# Altium schematic sheet Ant_V1_Sheet.SchDoc: AntV1
size A3; Author: Mrike.latefly; DocumentNumber: 5; Revision: v0.0.01; DocumentName: Ant_V1
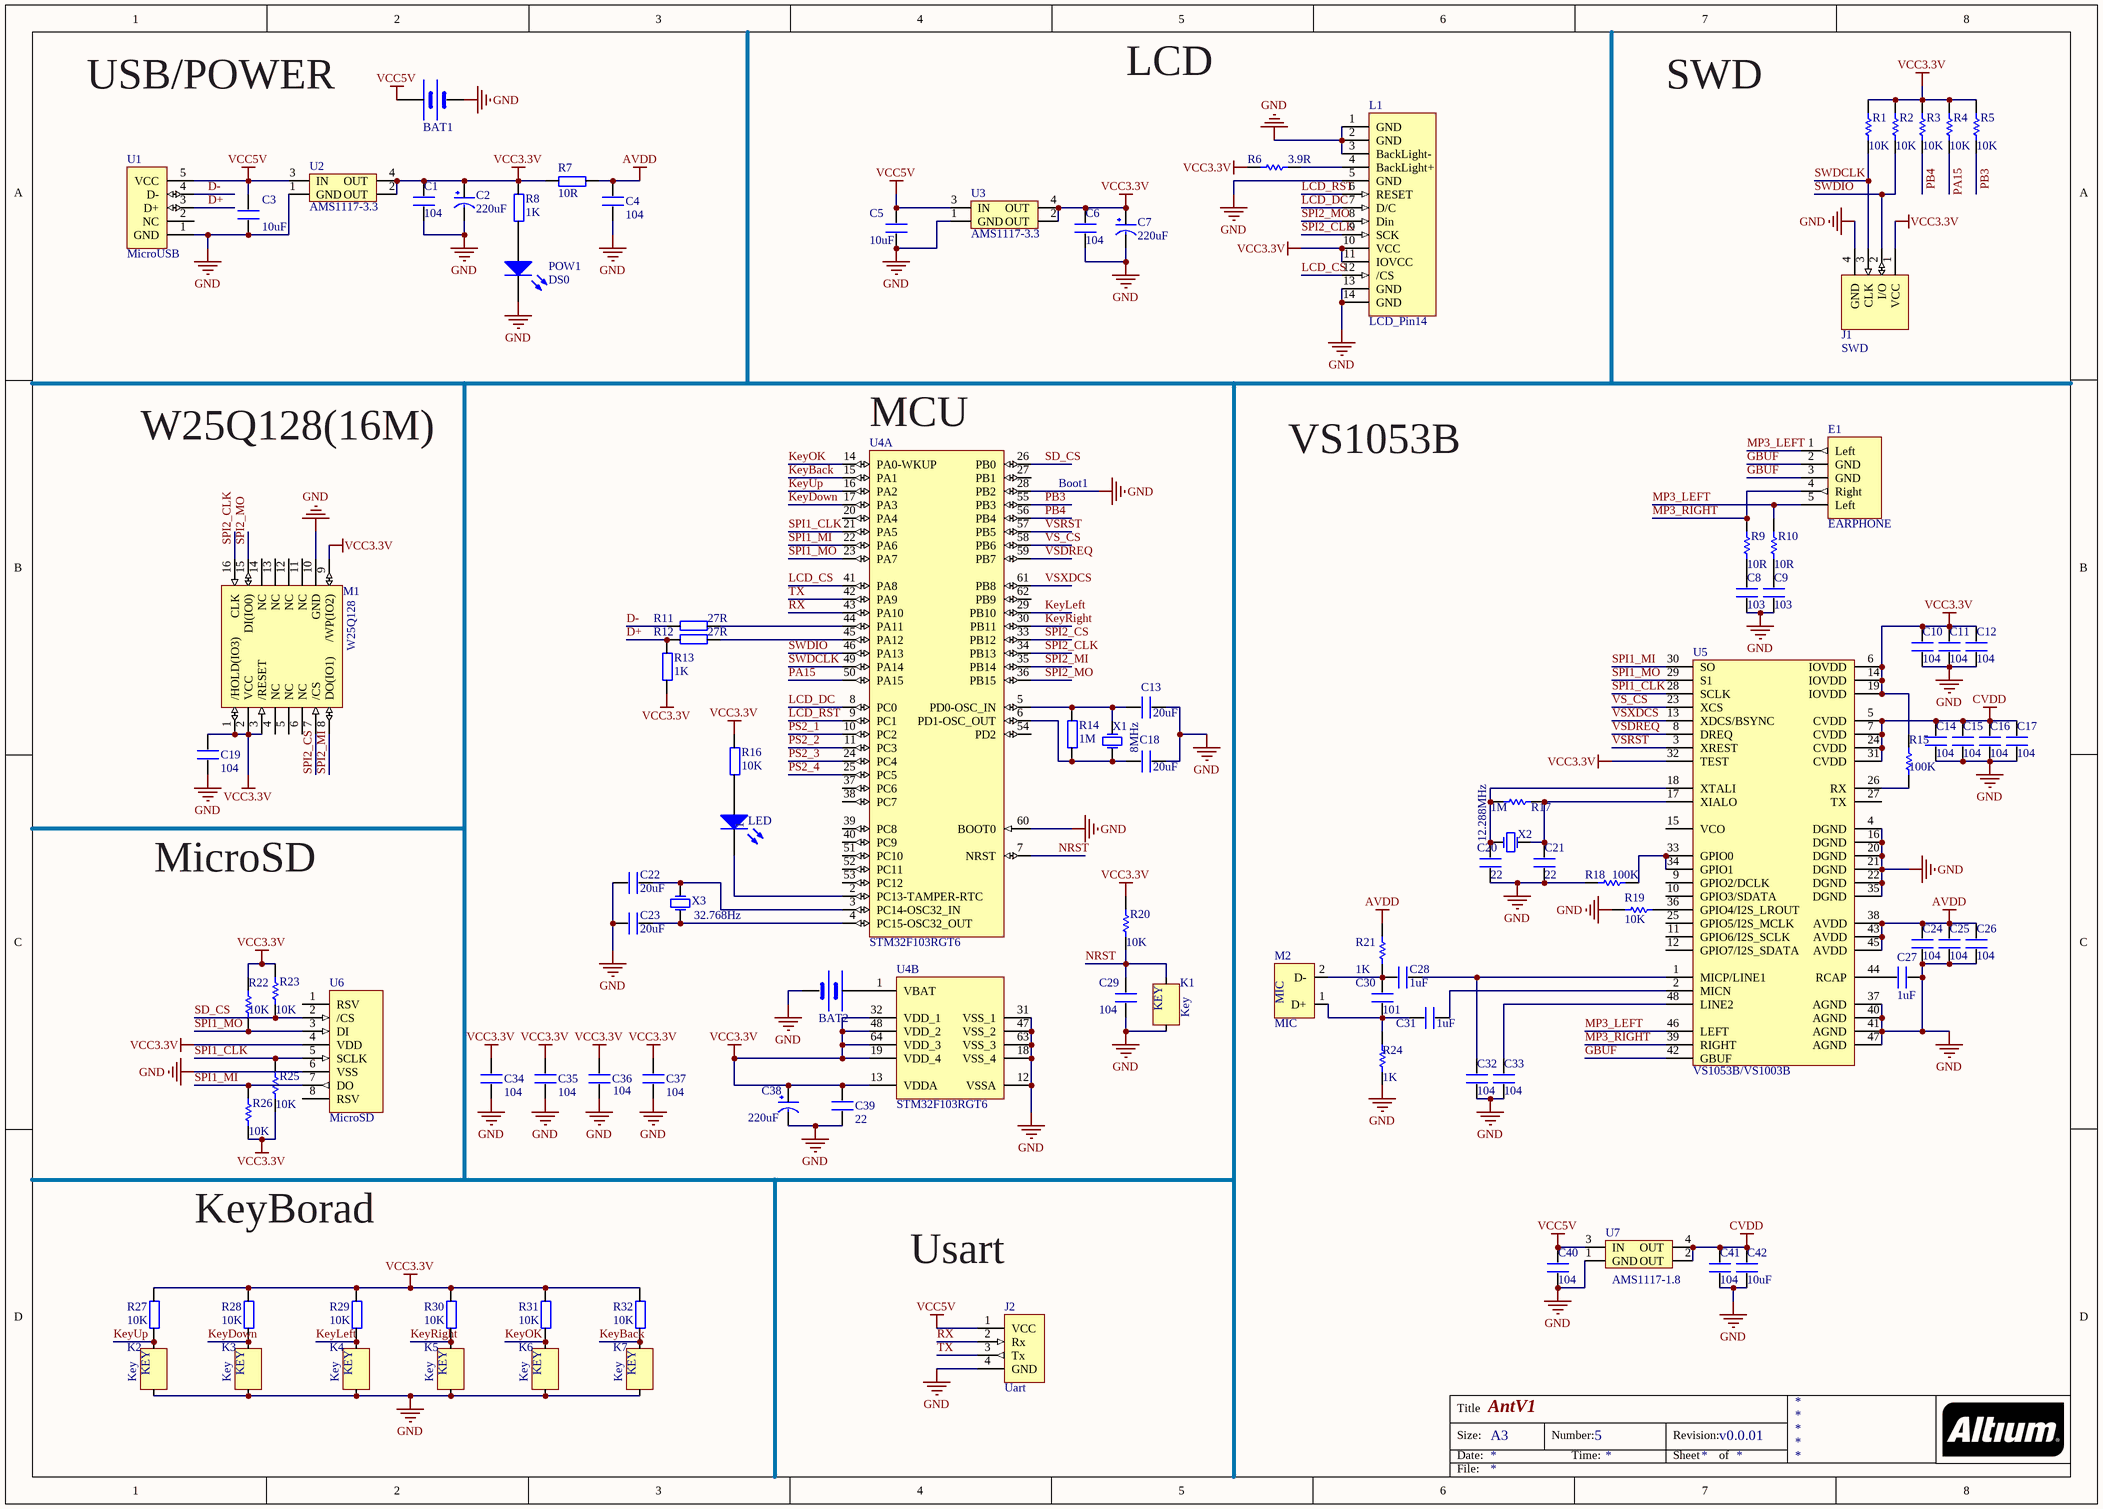
[diagram p0: Ant_V1_Sheet.SchDoc]

## Parts
1  LED  [LED_LITTLE]
BAT1  BATT  [BATTERY]  (value not drawn)
BAT2  BATT  [BATTERY]  (value not drawn)
C1  104  [0805]
C2  220uF  [0805]
C3  10uF  [0805]
C4  104  [0805]
C5  10uF  [0805]
C6  104  [0805]
C7  220uF  [0805]
C8  103  [0805]
C9  103  [0805]
C10  104  [0805]
C11  104  [0805]
C12  104  [0805]
C13  20uF  [0805]
C14  104  [0805]
C15  104  [0805]
C16  104  [0805]
C17  104  [0805]
C18  20uF  [0805]
C19  104  [0805]
C20  22  [0805]
C21  22  [0805]
C22  20uF  [0805]
C23  20uF  [0805]
C24  104  [0805]
C25  104  [0805]
C26  104  [0805]
C27  1uF  [0805]
C28  1uF  [0805]
C29  104  [0805]
C30  101  [0805]
C31  1uF  [0805]
C32  104  [0805]
C33  104  [0805]
C34  104  [0805]
C35  104  [0805]
C36  104  [0805]
C37  104  [0805]
C38  220uF  [0805]
C39  22  [0805]
C40  104  [0805]
C41  104  [0805]
C42  10uF  [0805]
E1  EARPHONE  [EARPHONE]
J1  SWD  [SWD]
J2  Uart  [Uart]
K1  Key  [KEY]
K2  Key  [KEY]
K3  Key  [KEY]
K4  Key  [KEY]
K5  Key  [KEY]
K6  Key  [KEY]
K7  Key  [KEY]
L1  LCD_Pin14  [LCD_PIN14_Rctify]
M1  W25Q128  [W25Q128]
M2  MIC  [MIC]
POW1  DS0  [LED_LITTLE]
R1  10K  [0805]
R2  10K  [0805]
R3  10K  [0805]
R4  10K  [0805]
R5  10K  [0805]
R6  3.9R  [0805]
R7  10R  [0805]
R8  1K  [0805]
R9  10R  [0805]
R10  10R  [0805]
R11  27R  [0805]
R12  27R  [0805]
R13  1K  [0805]
R14  1M  [0805]
R15  100K  [0805]
R16  10K  [0805]
R17  1M  [0805]
R18  100K  [0805]
R19  10K  [0805]
R20  10K  [0805]
R21  1K  [0805]
R22  10K  [0805]
R23  10K  [0805]
R24  1K  [0805]
R25  10K  [0805]
R26  10K  [0805]
R27  10K  [0805]
R28  10K  [0805]
R29  10K  [0805]
R30  10K  [0805]
R31  10K  [0805]
R32  10K  [0805]
U1  MicroUSB  [USB]
U2  AMS1117-3.3  [AMS1117]
U3  AMS1117-3.3  [AMS1117]
U4  STM32F103RGT6  [STM-LQFP64_M]  (parts A,B of 2)
U5  VS1053B/VS1003B  [mTQFP48]
U6  MicroSD  [MICROSD]
U7  AMS1117-1.8  [AMS1117]
X1  8MHz  [XTAL_8M]
X2  12.288MHz  [XTAL_12.288M]
X3  32.768Hz  [XTAL32.768K_4Pin']

## Nets
AVDD: C4.2 C24.1 C25.1 C26.1 R7.2 R21.1 U5.38(AVDD) U5.43(AVDD) U5.45(AVDD)
CVDD: C14.1 C15.1 C16.1 C17.1 C41.2 C42.2 U5.5(CVDD) U5.7(CVDD) U5.24(CVDD) U5.31(CVDD) U7.2(OUT) U7.4(OUT)
GND: BAT1.2(GND) BAT2.2(GND) C1.1 C2.2(GND) C3.1 C4.1 C5.1 C6.1 C7.2(GND) C8.2 C9.2 C10.2 C11.2 C12.2 C13.2 C14.2 C15.2 C16.2 C17.2 C18.2 C19.2 C20.2 C21.2 C22.1 C23.1 C24.2 C25.2 C26.2 C27.2 C29.1 C32.1 C33.1 C34.1 C35.1 C36.1 C37.1 C38.2(GND) C39.1 C40.1 C41.1 C42.1 J1.4(GND) J2.4(GND) K1.2(GND) K2.2(GND) K3.2(GND) K4.2(GND) K5.2(GND) K6.2(GND) K7.2(GND) L1.1(GND) L1.2(GND) L1.3(BackLight-) L1.5(GND) L1.13(GND) L1.14(GND) M1.10(GND) POW1.2(K) R18.2 R19.1 R24.2 U1.1(GND) U2.1(GND) U3.1(GND) U4.12(VSSA) U4.18(VSS_4) U4.28(PB2) U4.31(VSS_1) U4.47(VSS_2) U4.60(BOOT0) U4.63(VSS_3) U5.4(DGND) U5.16(DGND) U5.20(DGND) U5.21(DGND) U5.22(DGND) U5.35(DGND) U5.37(AGND) U5.40(AGND) U5.41(AGND) U5.47(AGND) U6.6(VSS) U7.1(GND)
VCC3.3V: C1.2 C2.1(VCC) C6.2 C7.1(VCC) C10.1 C11.1 C12.1 C19.1 C34.2 C35.2 C36.2 C37.2 C38.1(VCC) C39.2 J1.1(VCC) L1.10(VCC) L1.11(IOVCC) M1.1(/HOLD(IO3)) M1.2(VCC) M1.3(/RESET) M1.9(/WP(IO2)) R1.2 R2.2 R3.2 R4.2 R5.2 R6.2 R7.1 R8.2 R13.1 R15.2 R16.2 R20.2 R22.2 R23.2 R25.1 R26.1 R27.2 R28.2 R29.2 R30.2 R31.2 R32.2 U2.2(OUT) U2.4(OUT) U3.2(OUT) U3.4(OUT) U4.13(VDDA) U4.19(VDD_4) U4.32(VDD_1) U4.48(VDD_2) U4.64(VDD_3) U5.6(IOVDD) U5.14(IOVDD) U5.19(IOVDD) U5.32(TEST) U6.4(VDD)
VCC5V: BAT1.1(VCC) C3.2 C5.2 C40.2 J2.1(VCC) U1.5(VCC) U2.3(IN) U3.3(IN) U7.3(IN)
D+: R12.2 R13.2 U1.3(D+)
D-: R11.2 U1.4(D-)
GBUF: E1.2(GND) E1.3(GND) U5.42(GBUF)
KeyBack: K7.1(GND) R32.1 U4.15(PA1)
KeyDown: K3.1(GND) R28.1 U4.17(PA3)
KeyLeft: K4.1(GND) R29.1 U4.29(PB10)
KeyOK: K6.1(GND) R31.1 U4.14(PA0-WKUP)
KeyRight: K5.1(GND) R30.1 U4.30(PB11)
KeyUp: K2.1(GND) R27.1 U4.16(PA2)
LCD_CS: L1.12(/CS) U4.41(PA8)
LCD_DC: L1.7(D/C) U4.8(PC0)
LCD_RST: L1.6(RESET) U4.9(PC1)
MP3_LEFT: E1.1(Left) E1.5(Left) R10.2 U5.46(LEFT)
MP3_RIGHT: E1.4(Right) R9.2 U5.39(RIGHT)
NRST: C29.2 K1.1(GND) R20.1 U4.7(NRST)
PA15: R4.1 U4.50(PA15)
PB3: R5.1 U4.55(PB3)
PB4: R3.1 U4.56(PB4)
PS2_1: U4.10(PC2)
PS2_2: U4.11(PC3)
PS2_3: U4.24(PC4)
PS2_4: U4.25(PC5)
RX: J2.2(Rx) U4.43(PA10)
SD_CS: R23.1 U4.26(PB0) U6.2(/CS)
SPI1_CLK: R25.2 U4.21(PA5) U5.28(SCLK) U6.5(SCLK)
SPI1_MI: R26.2 U4.22(PA6) U5.30(SO) U6.7(DO)
SPI1_MO: R22.1 U4.23(PA7) U5.29(S1) U6.3(DI)
SPI2_CLK: L1.9(SCK) M1.16(CLK) U4.34(PB13)
SPI2_CS: M1.7(/CS) U4.33(PB12)
SPI2_MI: M1.8(DO(IO1)) U4.35(PB14)
SPI2_MO: L1.8(Din) M1.15(DI(IO0)) U4.36(PB15)
SWDCLK: J1.3(CLK) R1.1 U4.49(PA14)
SWDIO: J1.2(I/O) R2.1 U4.46(PA13)
TX: J2.3(Tx) U4.42(PA9)
VS_CS: U4.58(PB6) U5.23(XCS)
VSDREQ: U4.59(PB7) U5.8(DREQ)
VSRST: U4.57(PB5) U5.3(XREST)
VSXDCS: U4.61(PB8) U5.13(XDCS/BSYNC)
Net1_1: 1.1(A) R16.1
Net1_2: 1.2(K) U4.2(PC13-TAMPER-RTC)
NetBAT2_1: BAT2.1(VCC) U4.1(VBAT)
NetC8_1: C8.1 R9.1
NetC9_1: C9.1 R10.1
NetC13_1: C13.1 R14.2 U4.5(PD0-OSC_IN) X1.1(OSC1)
NetC18_1: C18.1 R14.1 U4.6(PD1-OSC_OUT) X1.2(OSC2)
NetC20_1: C20.1 R17.2 U5.18(XTALI) X2.1(OSC1)
NetC21_1: C21.1 R17.1 U5.17(XIALO) X2.2(OSC2)
NetC22_2: C22.2 U4.3(PC14-OSC32_IN) X3.2(OSC2)
NetC23_2: C23.2 U4.4(PC15-OSC32_OUT) X3.1(OSC1)
NetC27_1: C27.1 U5.44(RCAP)
NetC28_1: C28.1 C30.2 M2.2(D-) R21.2
NetC28_2: C28.2 C32.2 U5.1(MICP/LINE1)
NetC30_1: C30.1 C31.2 M2.1(D+) R24.1
NetC31_1: C31.1 U5.2(MICN)
NetC33_2: C33.2 U5.48(LINE2)
NetL1_4: L1.4(BackLight+) R6.1
NetPOW1_1: POW1.1(A) R8.1
NetR11_1: R11.1 U4.44(PA11)
NetR12_1: R12.1 U4.45(PA12)
NetR15_1: R15.1 U5.26(RX)
NetR18_1: R18.1 U5.33(GPIO0) U5.34(GPIO1)
NetR19_2: R19.2 U5.36(GPIO4/I2S_LROUT)

Not connected (* = marked no-connect by the designer): M1 4(NC) 5(NC) 6(NC) 11(NC) 12(NC) 13(NC) 14(NC); U1 2(NC); U4 20(PA4) 27(PB1) 37(PC6) 38(PC7) 39(PC8) 40(PC9) 51(PC10) 52(PC11) 53(PC12) 54(PD2) 62(PB9); U5 9(GPIO2/DCLK) 10(GPIO3/SDATA) 11(GPIO6/I2S_SCLK) 12(GPIO7/I2S_SDATA) 15(VCO) 25(GPIO5/I2S_MCLK) 27(TX); U6 1(RSV) 8(RSV)

## Notes on the sheet
- USB/POWER
- LCD
- SWD
- W25Q128(16M)
- (near U4) MCU
- Boot1
- VS1053B
- MicroSD
- KeyBorad
- Usart
- Title
- Size:
- Date:
- A3
- Number:
- Time:
- Revision:
- Sheet
- of
- File:
- (in symbol Key) KEY

## Library data of the parts
1 POW1 = LED2: Typical RED, GREEN, YELLOW, AMBER GaAs LED; Published: 8-Jun-2000; LatestRevisionDate: 17-Jul-2002; LatestRevisionNote: Re-released for DXP Platform.; PackageDocument: Feb-2002; PackageReference: 3.2X1.6X1.1; Publisher: Altium Limited
BAT1 BAT2 = BAT
C1 C4 C6 C8-C12 C14-C17 C20 C21 C24-C33 C39-C42 = C
C2 C7 C38 = CAP
C3 C5 C13 C18 C19 C22 C23 C34-C37 = C_2
R1-R6 R9 R10 R15 R17-R26 = Res1: Resistor; Published: 8-Jun-2000; LatestRevisionDate: 17-Jul-2002; LatestRevisionNote: Re-released for DXP Platform.; PackageReference: AXIAL-0.3; Publisher: Altium Limited; PackageDescription: Axial Device, Thru-Hole; 2 Leads; 0.3 in Pin Spacing
R7 R8 R11-R14 R16 R27-R32 = R
U2 U3 U7 = AMS1117
U4 = STM32F103RGT6: ARM Cortex-M3 32-bit MCU, 1024 KB Flash, 96 KB Internal RAM, 51 I/Os, 64-pin LQFP, -40 to 85 degC, Tray; A/D Converter: 3x12-bit (16 Channel); D/A Converter: 2x12-bit (2 Channel); FLASH Size (Prog) (kB): 1024; I/Os (High Current): 51; Internal RAM Size (kB): 96; Operating Frequency(F) (Processor speed) (MHz): 72; Supply Voltage(Vcc) min (V): 2; DatasheetVersion: Rev. 3; PackageVersion: Rev. 4, 06/2013; PackageReference: LQFP64; PackageDescription: 64-Pin Low Profile Quad Flat Package, 10 x 10 mm Body, 0.5 mm Pitch; Supplier 1: Digi-Key; Supplier Part Number 1: 497-11118-ND; Supplier 2: Farnell; Supplier Part Number 2: 2215220; Supplier 3: Newark; Supplier Part Number 3: 21T4016; Supplier 4: Mouser; Supplier Part Number 4: 511-STM32F103RGT6; Core: ARM Cortex-M3; Packing: Tray; Mounting Technology: Surface Mount; PartNumber: STM32F103RGT6; ComponentLink1Description: Manufacturer URL; ComponentLink1URL: http://www.st.com/web/en/home.html; ComponentLink2Description: Datasheet; ComponentLink2URL: http://www.st.com/st-web-ui/static/active/en/resource/technical/document/datasheet/CD00253742.pdf; ComponentLink3Description: Package Specification; ComponentLink3URL: http://www.st.com/st-web-ui/static/active/en/resource/technical/document/datasheet/DM00037051.pdf
U5 = VS1053
X1-X3 = XTAL: Crystal Oscillator; Published: 8-Jun-2000; LatestRevisionDate: 17-Jul-2002; LatestRevisionNote: Re-released for DXP Platform.; Publisher: Altium Limited